# EAGLE design backplane (EAGLE 8.6.3)

## Sheet 1 of 4
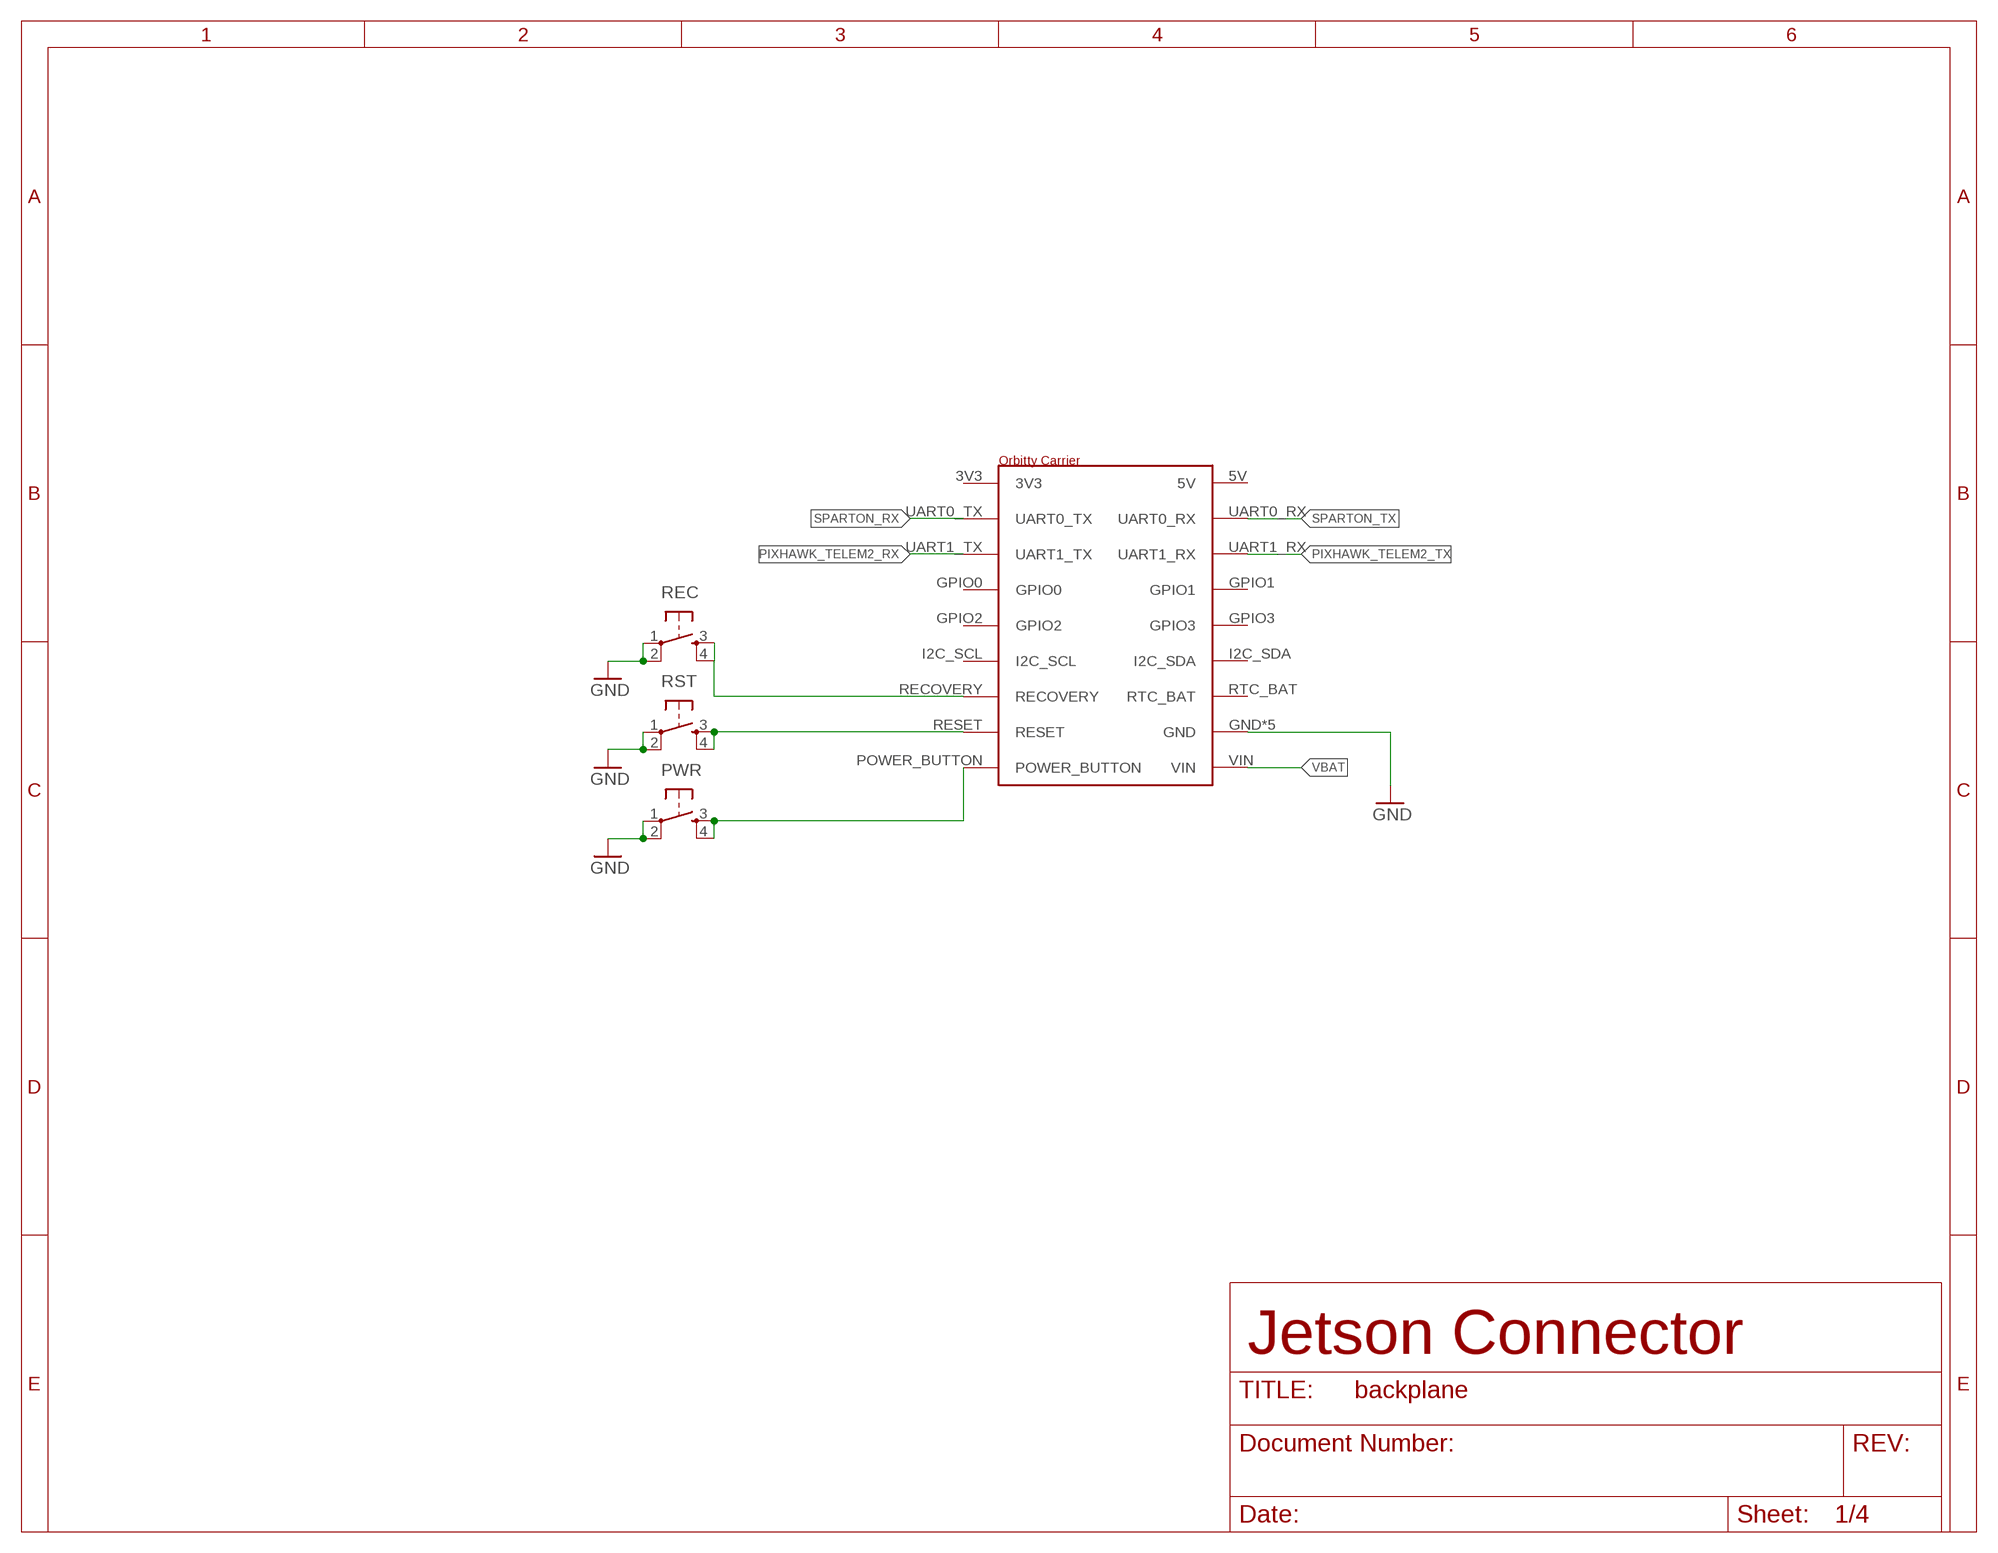
[diagram p0: schematic, sheet 1]

### Parts
PWR  TAC_SWITCHPTH  [TACTILE-PTH]
REC  TAC_SWITCHPTH  [TACTILE-PTH]
RST  TAC_SWITCHPTH  [TACTILE-PTH]
U$3  ORBITTY_CARRIER  [ORBITTY_CARRIER]

### Nets
GND: REC.1 REC.2 RST.1 RST.2 U$3.GND U$3.GND1(GND) U$3.GND2(GND) U$3.GND3(GND) U$3.GND4(GND) ; also sheet 3,4
N$3: PWR.3 PWR.4 U$3.POWER_BUTTON
N$4: RST.3 RST.4 U$3.RESET
N$5: REC.3 REC.4 U$3.RECOVERY
PIXHAWK_TELEM2_RX: U$3.UART1_TX
PIXHAWK_TELEM2_TX: U$3.UART1_RX
PWR: PWR.1 PWR.2 ; supply symbol labelled GND
SPARTON_RX: U$3.UART0_TX
SPARTON_TX: U$3.UART0_RX
VBAT: U$3.VIN
Unconnected: U$3.3V3 U$3.5V U$3.GPIO0 U$3.GPIO1 U$3.GPIO2 U$3.GPIO3 U$3.I2C_SCL U$3.I2C_SDA U$3.RTC_BAT

### Notes on the sheet
- Jetson Connector

## Sheet 2 of 4
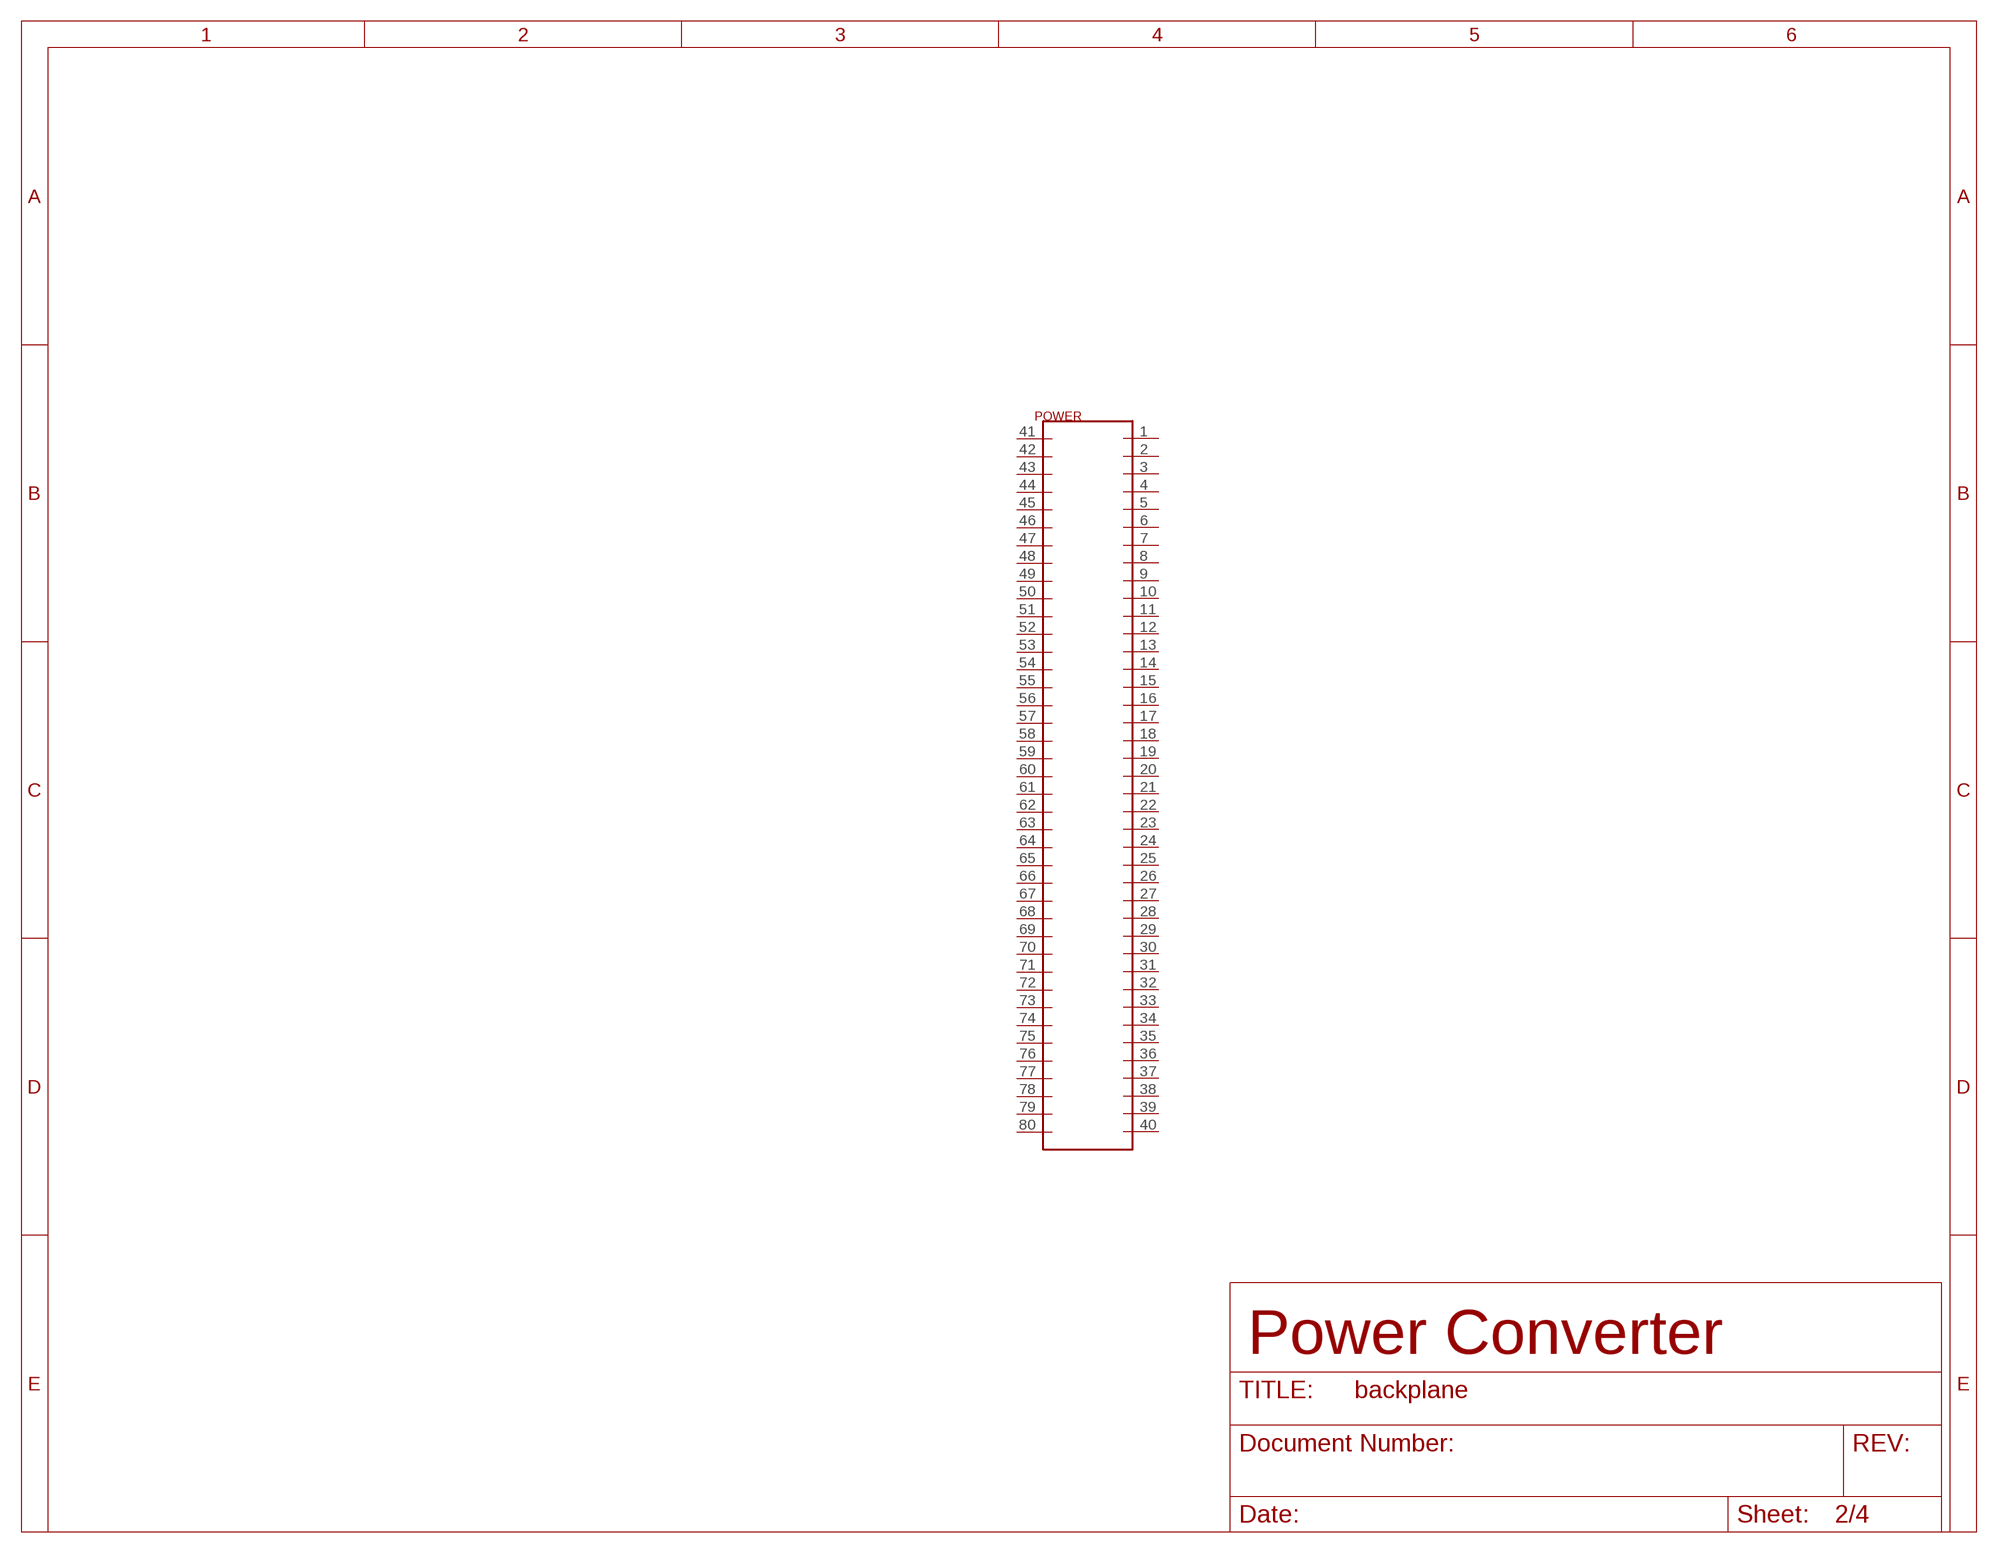
[diagram p1: schematic, sheet 2]

### Parts
POWER  TE-2-5530843-0  [TE-2-5530843-0]
Unconnected: POWER.1 POWER.2 POWER.3 POWER.4 POWER.5 POWER.6 POWER.7 POWER.8 POWER.9 POWER.10 POWER.11 POWER.12 POWER.13 POWER.14 POWER.15 POWER.16 POWER.17 POWER.18 POWER.19 POWER.20 POWER.21 POWER.22 POWER.23 POWER.24 POWER.25 POWER.26 POWER.27 POWER.28 POWER.29 POWER.30 POWER.31 POWER.32 POWER.33 POWER.34 POWER.35 POWER.36 POWER.37 POWER.38 POWER.39 POWER.40 POWER.41 POWER.42 POWER.43 POWER.44 POWER.45 POWER.46 POWER.47 POWER.48 POWER.49 POWER.50 POWER.51 POWER.52 POWER.53 POWER.54 POWER.55 POWER.56 POWER.57 POWER.58 POWER.59 POWER.60 POWER.61 POWER.62 POWER.63 POWER.64 POWER.65 POWER.66 POWER.67 POWER.68 POWER.69 POWER.70 POWER.71 POWER.72 POWER.73 POWER.74 POWER.75 POWER.76 POWER.77 POWER.78 POWER.79 POWER.80

### Notes on the sheet
- Power Converter

## Sheet 3 of 4
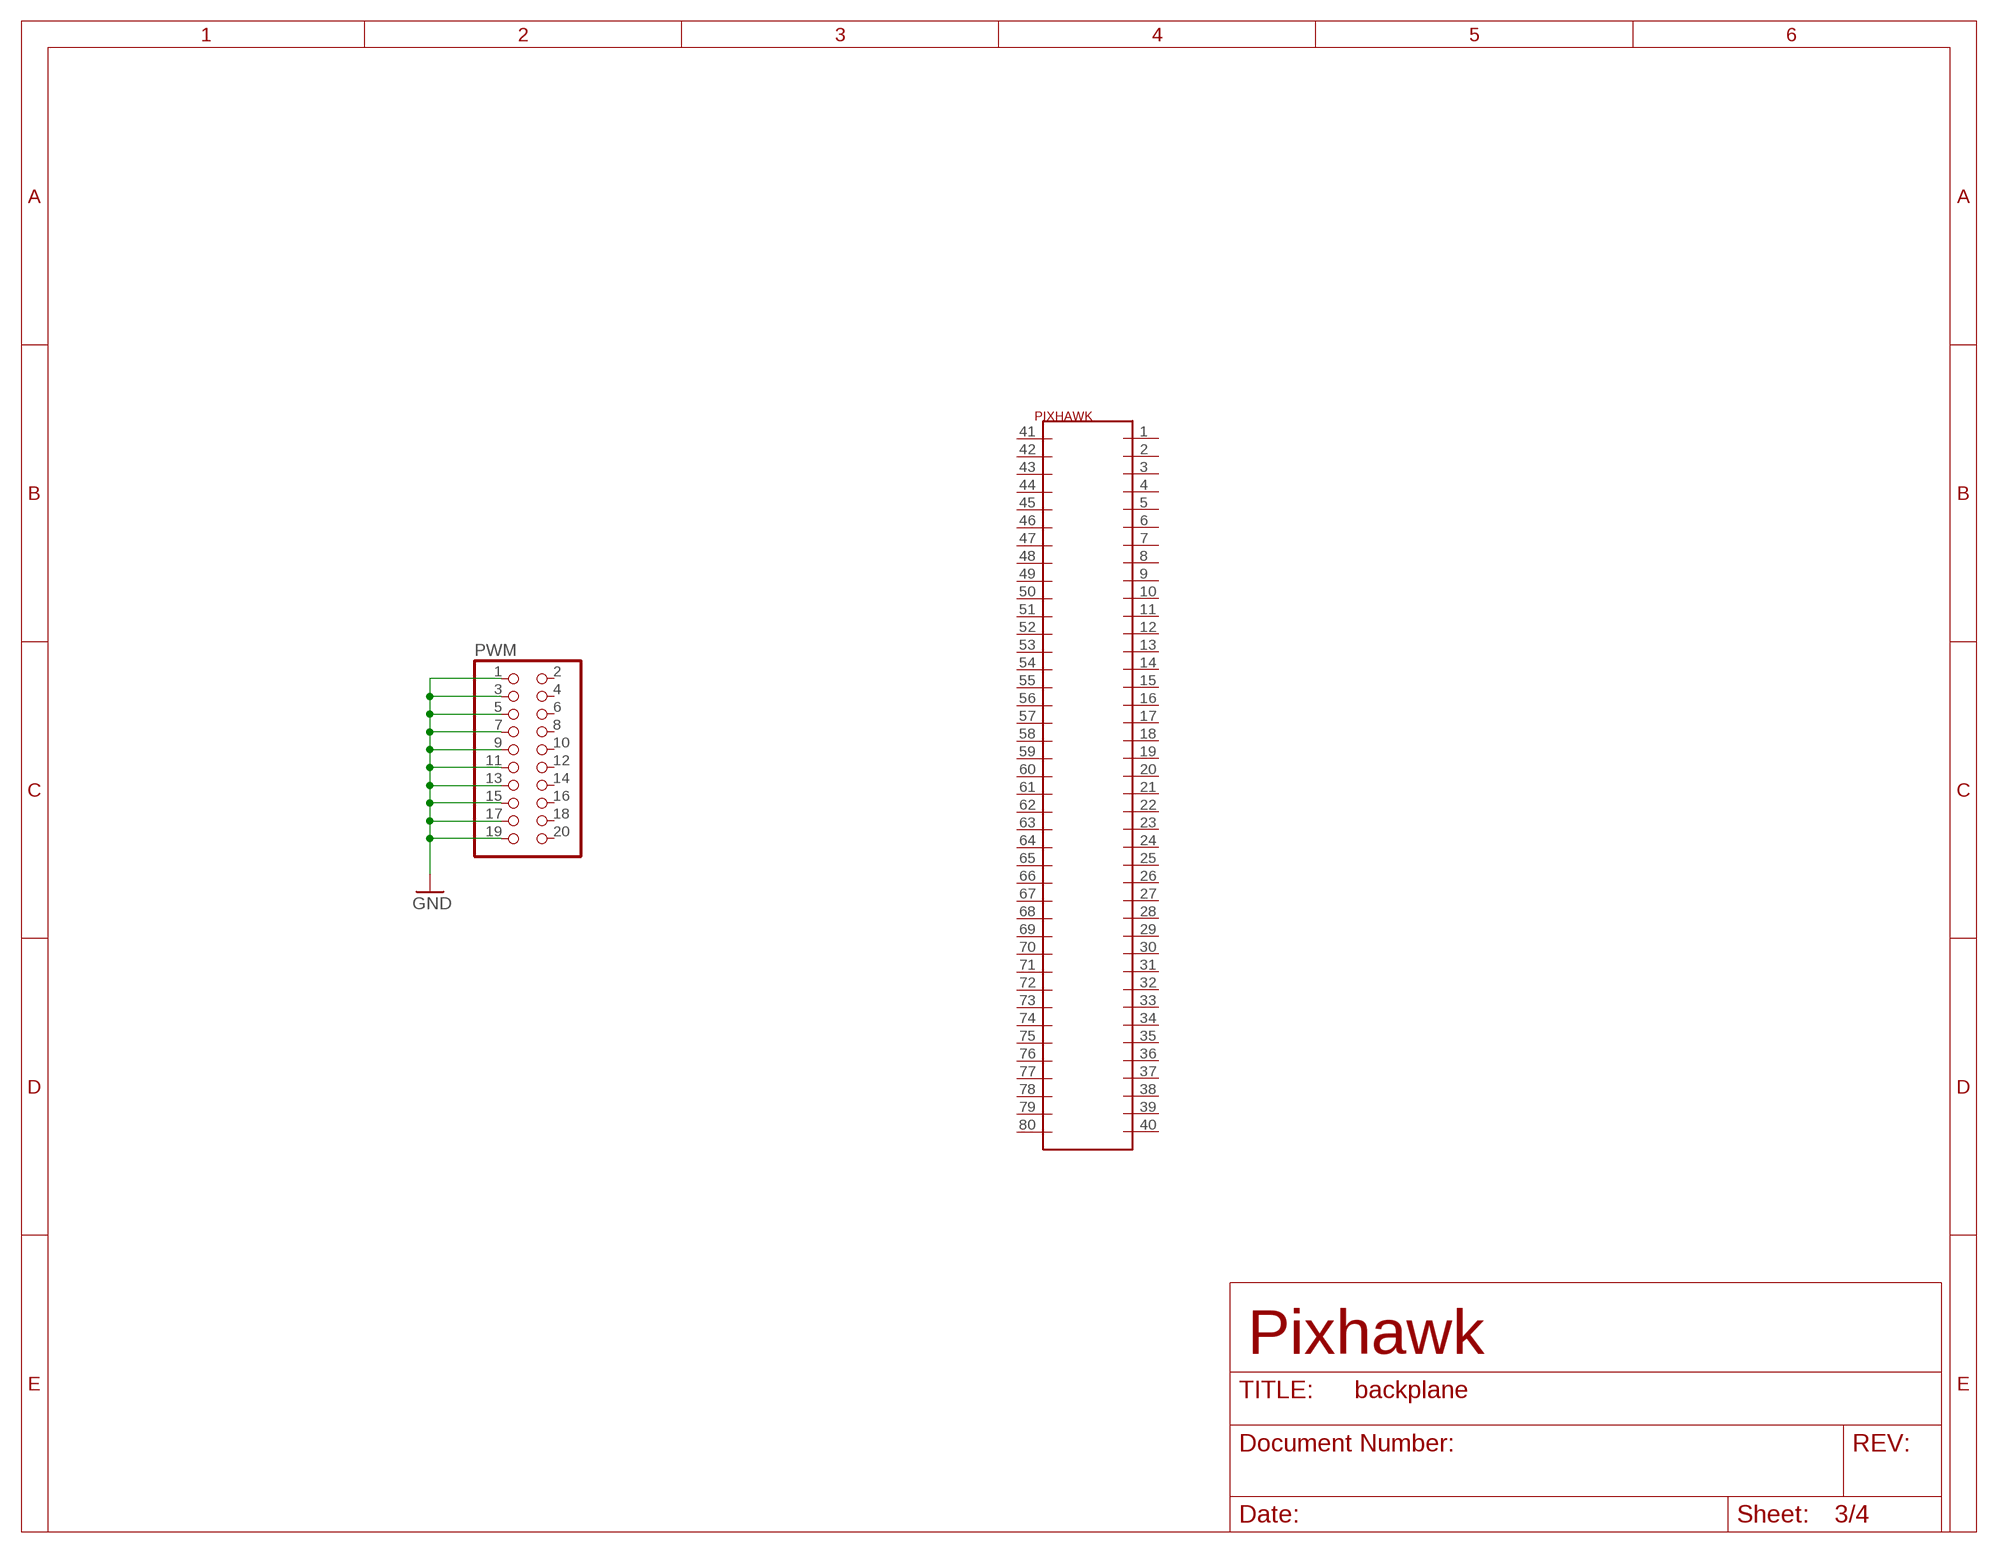
[diagram p2: schematic, sheet 3]

### Parts
PIXHAWK  TE-2-5530843-0  [TE-2-5530843-0]
PWM  PINHD-2X10  [2X10]

### Nets
GND: PWM.1 PWM.3 PWM.5 PWM.7 PWM.9 PWM.11 PWM.13 PWM.15 PWM.17 PWM.19 ; also sheet 1,4
Unconnected: PIXHAWK.1 PIXHAWK.2 PIXHAWK.3 PIXHAWK.4 PIXHAWK.5 PIXHAWK.6 PIXHAWK.7 PIXHAWK.8 PIXHAWK.9 PIXHAWK.10 PIXHAWK.11 PIXHAWK.12 PIXHAWK.13 PIXHAWK.14 PIXHAWK.15 PIXHAWK.16 PIXHAWK.17 PIXHAWK.18 PIXHAWK.19 PIXHAWK.20 PIXHAWK.21 PIXHAWK.22 PIXHAWK.23 PIXHAWK.24 PIXHAWK.25 PIXHAWK.26 PIXHAWK.27 PIXHAWK.28 PIXHAWK.29 PIXHAWK.30 PIXHAWK.31 PIXHAWK.32 PIXHAWK.33 PIXHAWK.34 PIXHAWK.35 PIXHAWK.36 PIXHAWK.37 PIXHAWK.38 PIXHAWK.39 PIXHAWK.40 PIXHAWK.41 PIXHAWK.42 PIXHAWK.43 PIXHAWK.44 PIXHAWK.45 PIXHAWK.46 PIXHAWK.47 PIXHAWK.48 PIXHAWK.49 PIXHAWK.50 PIXHAWK.51 PIXHAWK.52 PIXHAWK.53 PIXHAWK.54 PIXHAWK.55 PIXHAWK.56 PIXHAWK.57 PIXHAWK.58 PIXHAWK.59 PIXHAWK.60 PIXHAWK.61 PIXHAWK.62 PIXHAWK.63 PIXHAWK.64 PIXHAWK.65 PIXHAWK.66 PIXHAWK.67 PIXHAWK.68 PIXHAWK.69 PIXHAWK.70 PIXHAWK.71 PIXHAWK.72 PIXHAWK.73 PIXHAWK.74 PIXHAWK.75 PIXHAWK.76 PIXHAWK.77 PIXHAWK.78 PIXHAWK.79 PIXHAWK.80 PWM.2 PWM.4 PWM.6 PWM.8 PWM.10 PWM.12 PWM.14 PWM.16 PWM.18 PWM.20

### Notes on the sheet
- Pixhawk

## Sheet 4 of 4
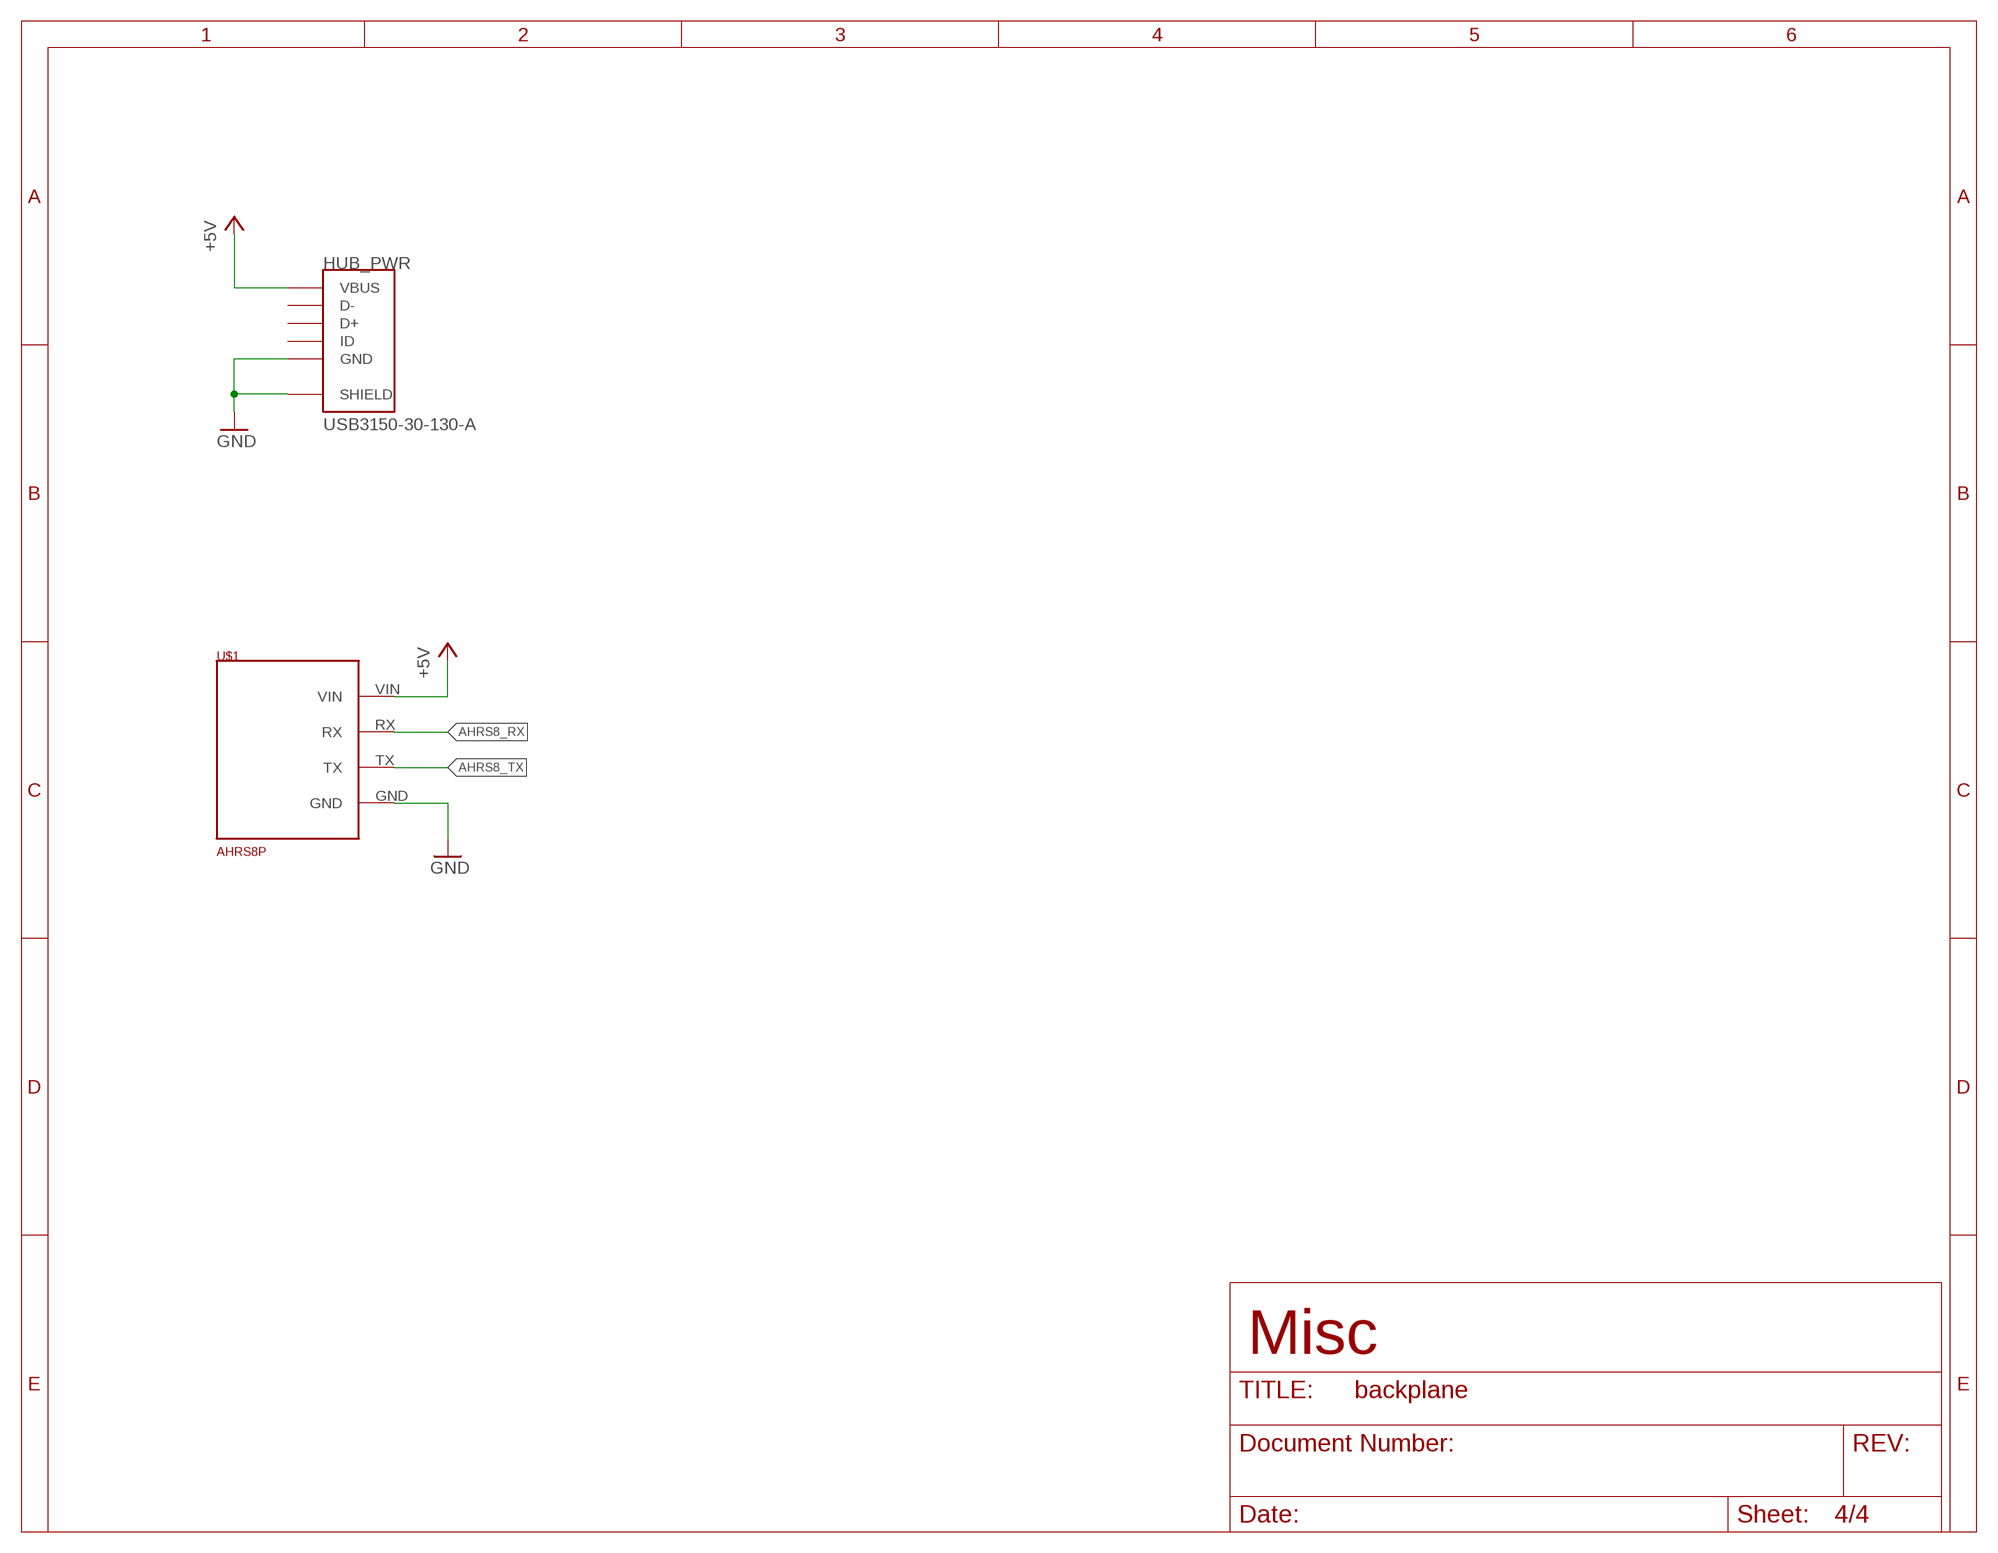
[diagram p3: schematic, sheet 4]

### Parts
HUB_PWR  USB3150-30-130-A  [GCT_USB3150-XX-XXX-X_REVA]
U$1  AHRS8P  [AHRS8P]

### Nets
+5V: HUB_PWR.1(VBUS) U$1.VIN
AHRS8_RX: U$1.RX
AHRS8_TX: U$1.TX
GND: HUB_PWR.5(GND) HUB_PWR.6(SHIELD) HUB_PWR.7(SHIELD) HUB_PWR.8(SHIELD) HUB_PWR.9(SHIELD) HUB_PWR.10(SHIELD) HUB_PWR.11(SHIELD) U$1.GND ; also sheet 1,3
Unconnected: HUB_PWR.2(D-) HUB_PWR.3(D+) HUB_PWR.4(ID)

### Notes on the sheet
- Misc

## Library data of the parts
HUB_PWR = auv:USB3150-30-130-A: Micro USB Plug, Type B, Through-Hole, Vertical, with Shell Stakes, with Locating Pegs; AVAILABILITY: Good; DESCRIPTION: Vertical Through Hole Type B Micro USB Plug w/ Shell Stakes and Pegs; MF: Global Connector Technology; MP: USB3150-30-130-A; PACKAGE: None; PRICE: 0.70 USD
PIXHAWK POWER = auv:TE-2-5530843-0
PWM = auv:PINHD-2X10: PIN HEADER
PWR REC RST = auv:TAC_SWITCH: Momentary Switch Button commonly used for reset or general input. Spark Fun Electronics SKU : COM-00097 SMT- SWCH-08247
U$1 = auv:AHRS8P
U$3 = auv:ORBITTY_CARRIER

## Board
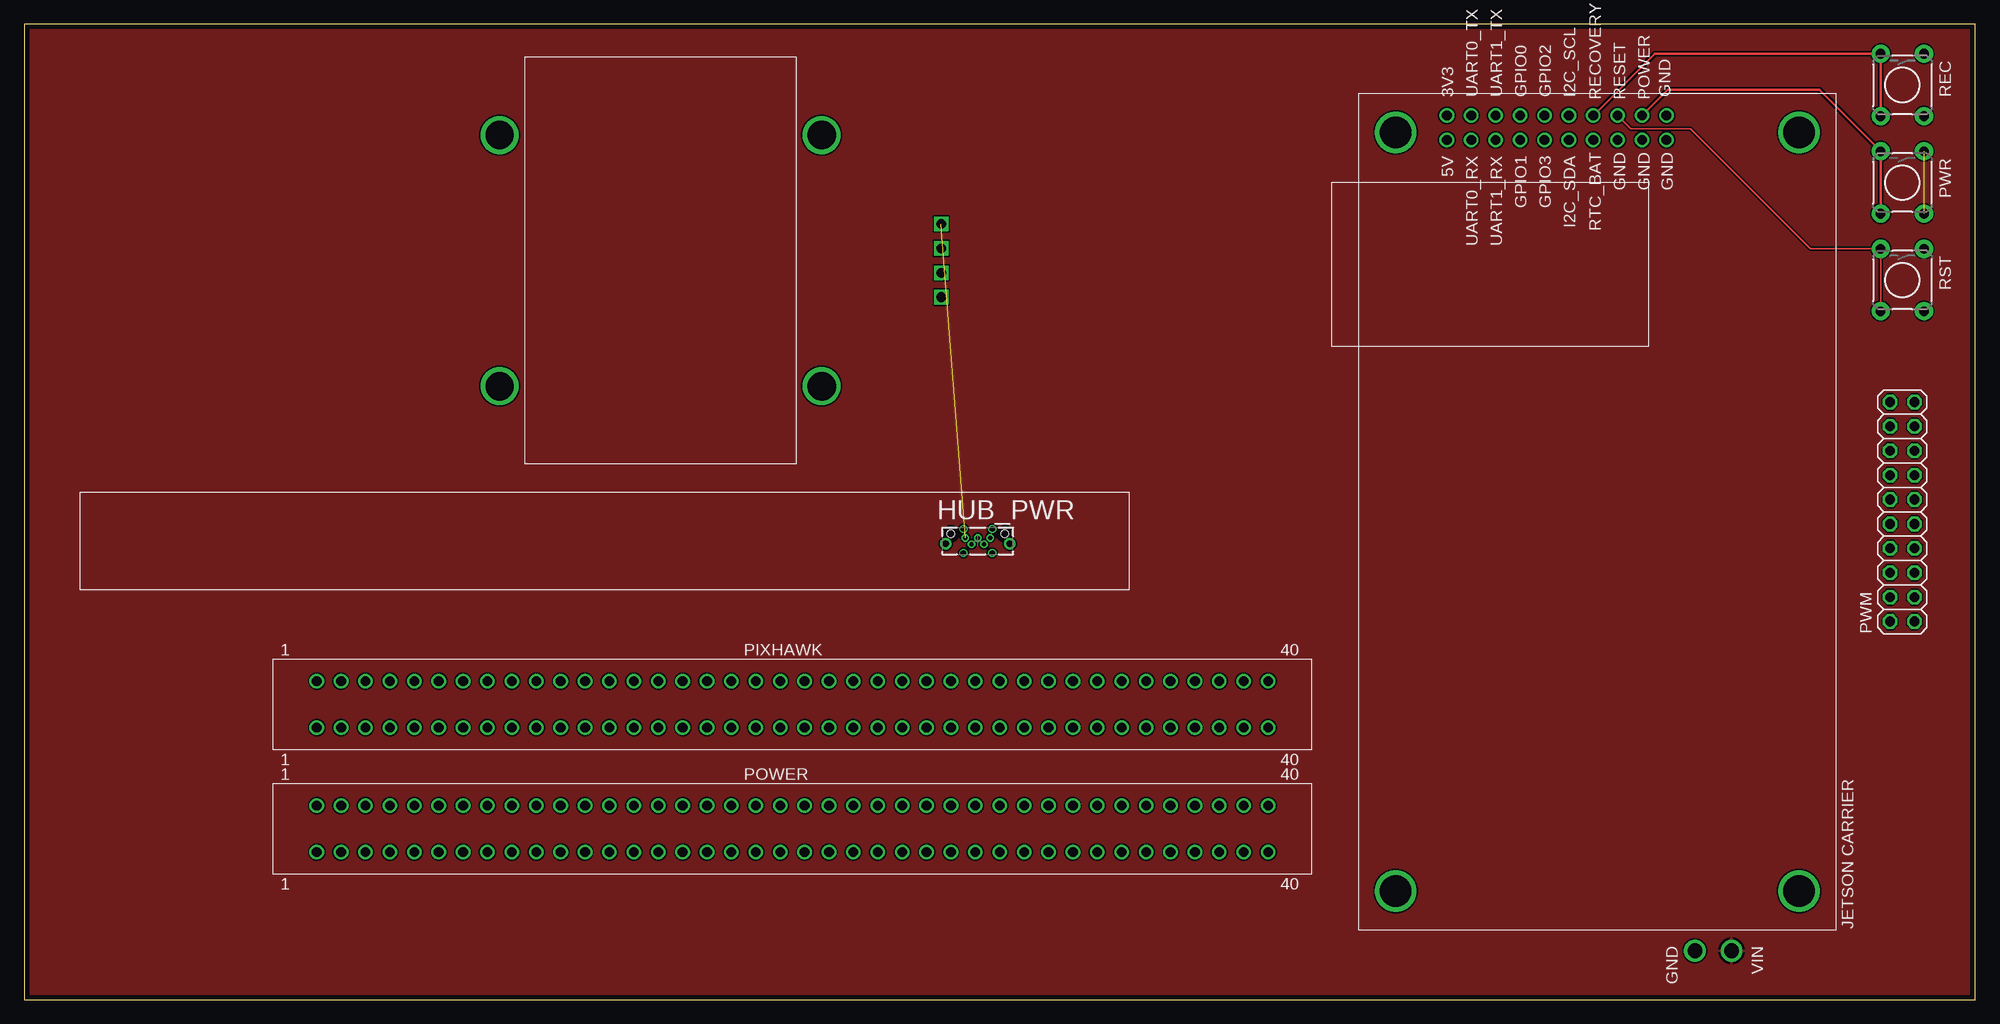
[diagram p4: board, top side]
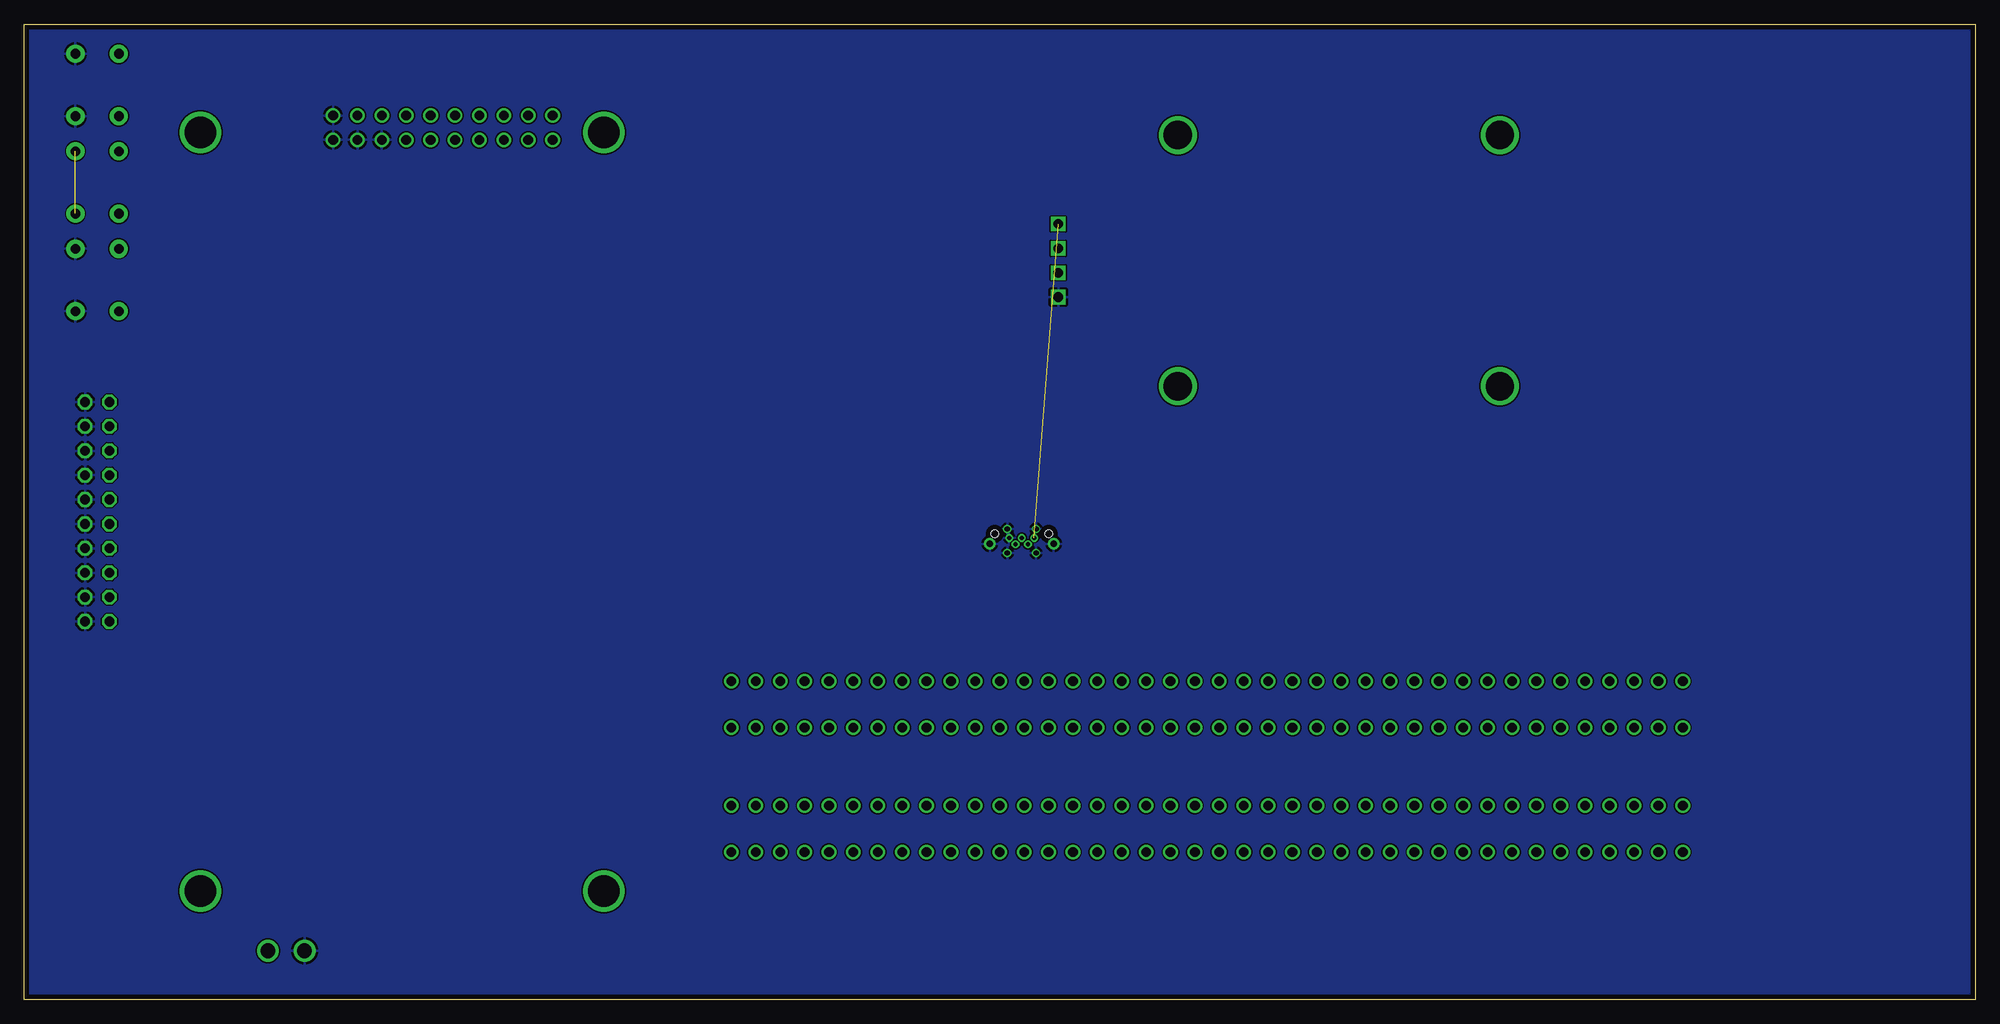
[diagram p5: board, bottom side, seen from below]

Size 203.2 x 101.6 mm. Coordinates in mm from the lower left corner, seen from the top.
Outline: 0,0 203.2,0 203.2,101.6 0,101.6 0,0
Copper layers (1*16): Top 0.035mm / dielectric 1.5mm / Bottom 0.035mm
Design rules "default *": minimum track width 4mil, minimum drill 8mil, track to track 6mil, track to pad 6mil, pad to pad 6mil, via to via 6mil, smd to smd 6mil, copper to edge 20mil, drill to drill 8mil, minimum pad ring 6mil, minimum via ring 6mil, stop-mask expansion 4mil, vias tented up to drill 0mil, thermal gap 10mil

### Footprints (pad centres in the part's own frame; a part is rotated, then mirrored left to right if it is on the bottom)
GCT_USB3150-XX-XXX-X_REVA = drill 0.45 pad 0.8: 1 -1.3,0.325; 2 -0.65,-0.325; 3 0,0.325; 4 0.65,-0.325; 5 1.3,0.325 | drill 0.7 pad 1.2: 6 -3.325,-0.295; 7 3.325,-0.295 | drill 0.55 pad 0.8: 8 -1.5,1.245; 9 1.5,1.245; 10 -1.5,-1.255; 11 1.5,-1.255 | hole 0.8: -2.8,0.745; 2.8,0.745
TE-2-5530843-0 = drill 1.016: 1 -49.53,2.426; 2 -46.99,2.426; 3 -44.45,2.426; 4 -41.91,2.426; 5 -39.37,2.426; 6 -36.83,2.426; 7 -34.29,2.426; 8 -31.75,2.426; 9 -29.21,2.426; 10 -26.67,2.426; 11 -24.13,2.426; 12 -21.59,2.426; 13 -19.05,2.426; 14 -16.51,2.426; 15 -13.97,2.426; 16 -11.43,2.426; 17 -8.89,2.426; 18 -6.35,2.426; 19 -3.81,2.426; 20 -1.27,2.426; 21 1.27,2.426; 22 3.81,2.426; 23 6.35,2.426; 24 8.89,2.426; 25 11.43,2.426; 26 13.97,2.426; 27 16.51,2.426; 28 19.05,2.426; 29 21.59,2.426; 30 24.13,2.426; 31 26.67,2.426; 32 29.21,2.426; 33 31.75,2.426; 34 34.29,2.426; 35 36.83,2.426; 36 39.37,2.426; 37 41.91,2.426; 38 44.45,2.426; 39 46.99,2.426; 40 49.53,2.426; 41 -49.53,-2.426; 42 -46.99,-2.426; 43 -44.45,-2.426; 44 -41.91,-2.426; 45 -39.37,-2.426; 46 -36.83,-2.426; 47 -34.29,-2.426; 48 -31.75,-2.426; 49 -29.21,-2.426; 50 -26.67,-2.426; 51 -24.13,-2.426; 52 -21.59,-2.426; 53 -19.05,-2.426; 54 -16.51,-2.426; 55 -13.97,-2.426; 56 -11.43,-2.426; 57 -8.89,-2.426; 58 -6.35,-2.426; 59 -3.81,-2.426; 60 -1.27,-2.426; 61 1.27,-2.426; 62 3.81,-2.426; 63 6.35,-2.426; 64 8.89,-2.426; 65 11.43,-2.426; 66 13.97,-2.426; 67 16.51,-2.426; 68 19.05,-2.426; 69 21.59,-2.426; 70 24.13,-2.426; 71 26.67,-2.426; 72 29.21,-2.426; 73 31.75,-2.426; 74 34.29,-2.426; 75 36.83,-2.426; 76 39.37,-2.426; 77 41.91,-2.426; 78 44.45,-2.426; 79 46.99,-2.426; 80 49.53,-2.426
2X10 = drill 1.016 octagon: 1 -11.43,-1.27; 2 -11.43,1.27; 3 -8.89,-1.27; 4 -8.89,1.27; 5 -6.35,-1.27; 6 -6.35,1.27; 7 -3.81,-1.27; 8 -3.81,1.27; 9 -1.27,-1.27; 10 -1.27,1.27; 11 1.27,-1.27; 12 1.27,1.27; 13 3.81,-1.27; 14 3.81,1.27; 15 6.35,-1.27; 16 6.35,1.27; 17 8.89,-1.27; 18 8.89,1.27; 19 11.43,-1.27; 20 11.43,1.27
TACTILE-PTH = drill 1.016 pad 1.88: 1 -3.251,2.261; 2 3.251,2.261; 3 -3.251,-2.261; 4 3.251,-2.261
AHRS8P = drill 1.016 square: GND -3.81,-29.21; RX -1.27,-29.21; TX 1.27,-29.21; VIN 3.81,-29.21 | drill 2.946: P$1 -13.081,-16.764; P$2 -13.081,16.764; P$3 13.081,16.764; P$4 13.081,-16.764
ORBITTY_CARRIER = drill 1.016: 3V3 41.275,15.672; 5V 38.735,15.672; GND 41.275,-7.188; GND1 38.735,-7.188; GND2 38.735,-4.648; GND3 38.735,-2.108; GPIO0 41.275,8.052; GPIO1 38.735,8.052; GPIO2 41.275,5.512; GPIO3 38.735,5.512; I2C_SCL 41.275,2.972; I2C_SDA 38.735,2.972; POWER_BUTTON 41.275,-4.648; RECOVERY 41.275,0.432; RESET 41.275,-2.108; RTC_BAT 38.735,0.432; UART0_RX 38.735,13.132; UART0_TX 41.275,13.132; UART1_RX 38.735,10.592; UART1_TX 41.275,10.592 | drill 1.524: GND4 -45.72,-10.16; VIN -45.72,-13.97 | drill 3.3: P$1 -39.497,21.006; P$2 -39.497,-21.006; P$3 39.497,-21.006; P$4 39.497,21.006

### Placement (x,y rotation side)
HUB_PWR  99.31,47.75 0 top
PIXHAWK  80.01,30.73 0 top
POWER  80.01,17.78 0 top
PWM  195.58,50.8 90 top
PWR  195.58,85.09 270 top
REC  195.58,95.25 270 top
RST  195.58,74.93 270 top
U$1  66.29,76.96 90 top
U$3  163.83,50.8 90 top

### Tracks (layer width: path | path; a pad name or v marks a point on that pad's centre or on a via)
+5V  (1 unrouted)
GND
  pour Bottom: 209.55,101.6 0,101.6 0,-3.81 209.55,-3.81
N$3
  Top 0.254: U$3.POWER_BUTTON 171.15,94.74 186.92,94.74 PWR.3 PWR.4
N$4
  Top 0.152: U$3.RESET 167.34,90.68 173.48,90.68 185.98,78.18 RST.3 RST.4
N$5
  Top 0.254: U$3.RECOVERY 169.82,98.5 REC.3 REC.4
PWR  (1 unrouted)
VBAT
  pour Top: 0,101.6 209.55,101.6 209.55,-3.81 0,-3.81